# EAGLE schematic onboard_v1.1 (EAGLE 8.1.0)
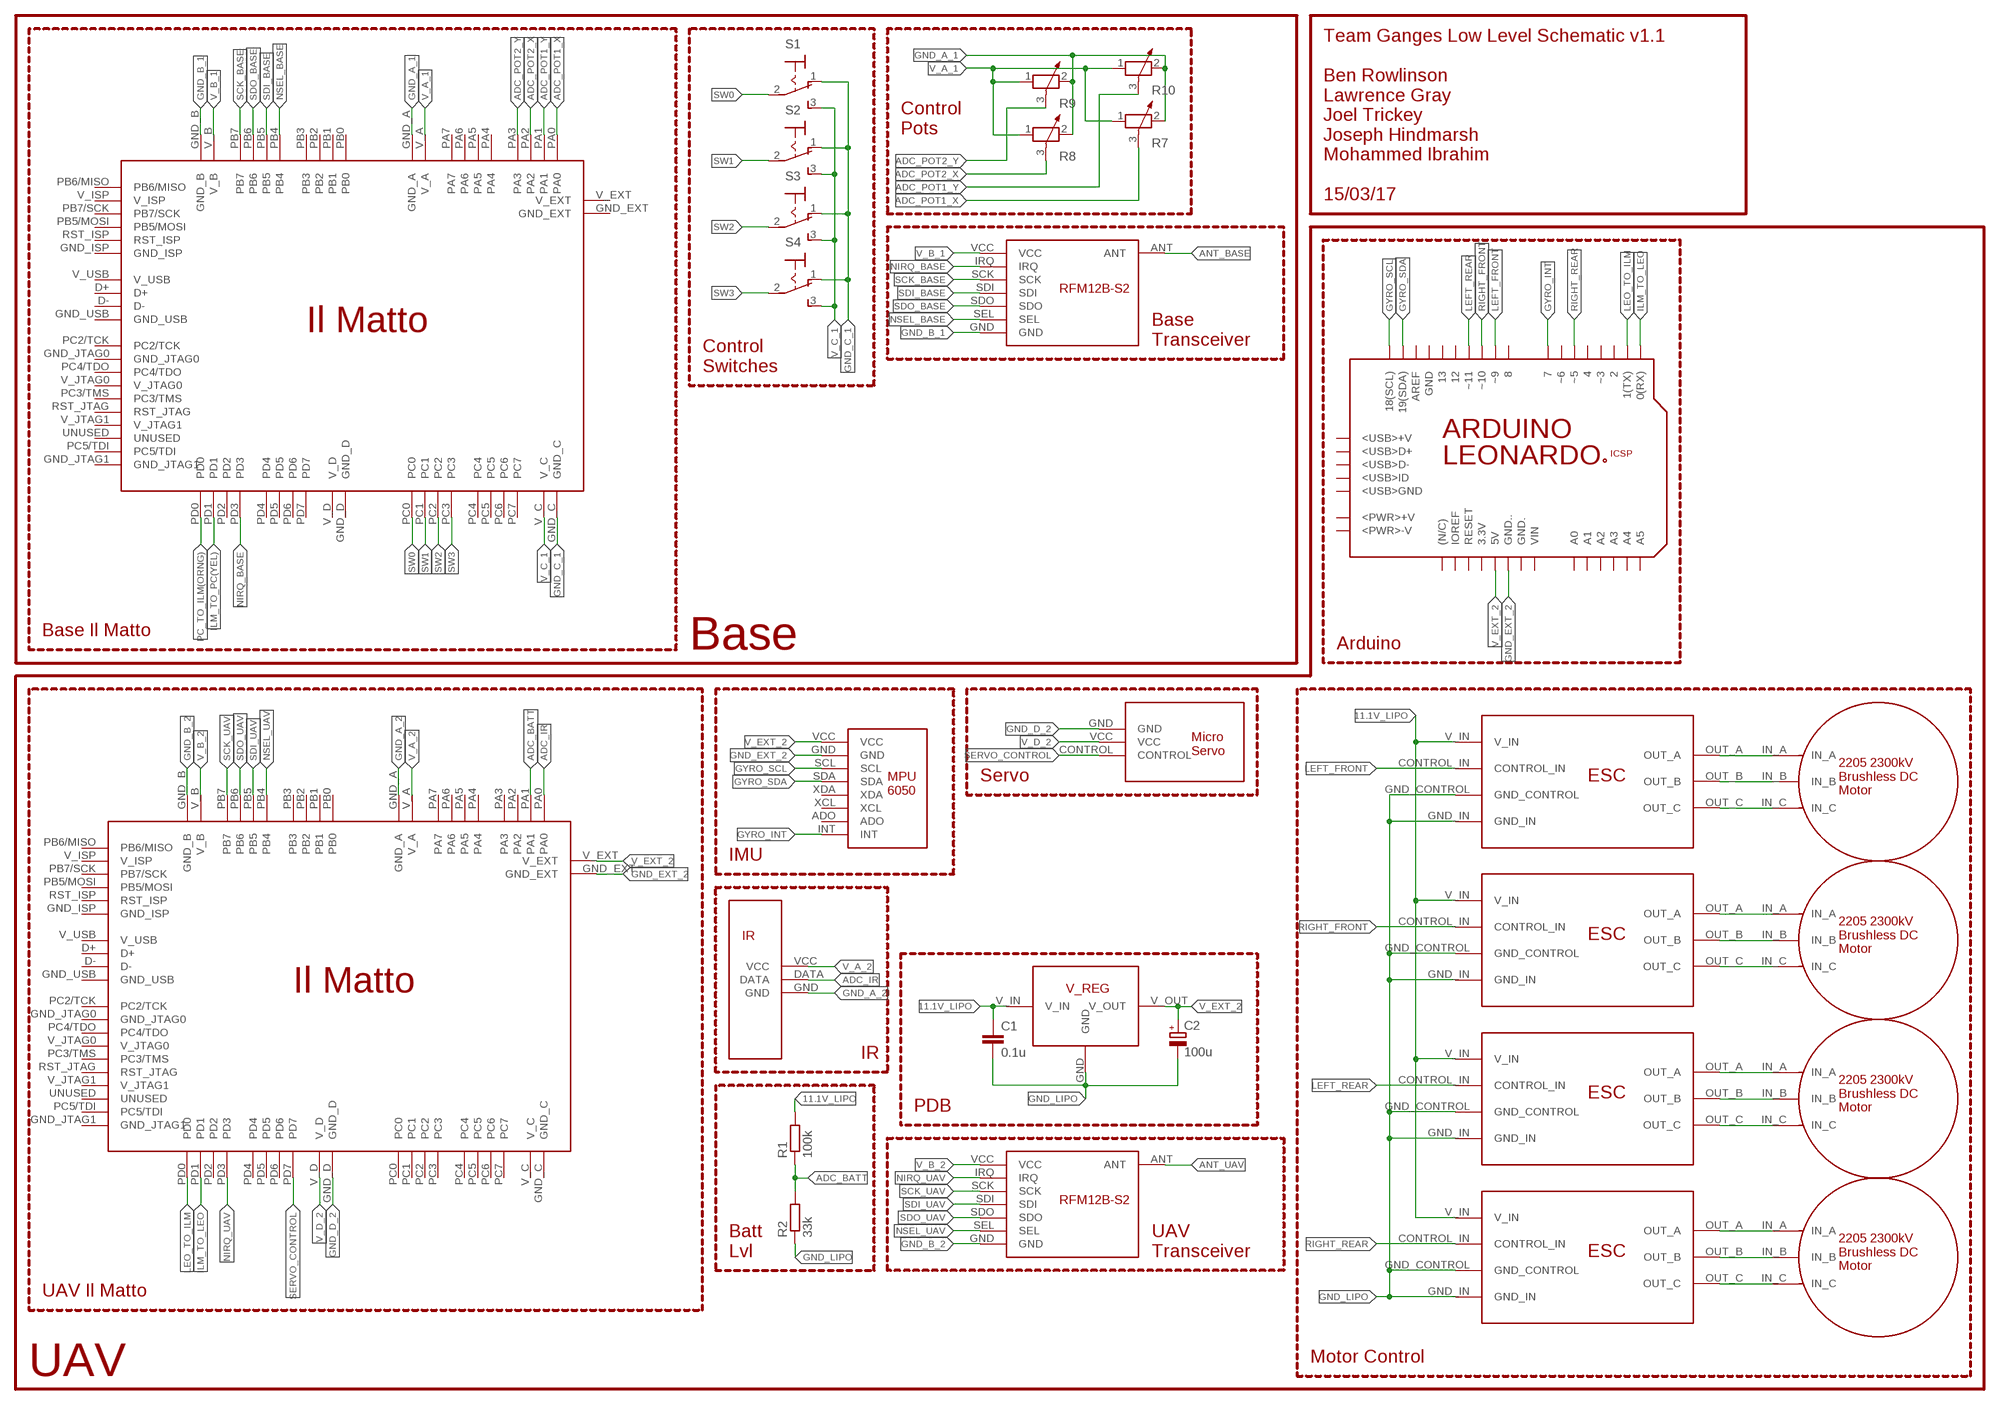
[diagram p0: schematic, sheet 1]

## Parts
C1  0.1u  C-EU025-024X044  [C025-024X044]
C2  100u  CPOL-EUB45181C  [B45181C]
LEFT_FRONT_ESC  ESC  [ESC]
LEFT_FRONT_MOTOR  MOTOR  [MOTOR]
LEFT_REAR_ESC  ESC  [ESC]
LEFT_REAR_MOTOR  MOTOR  [MOTOR]
PCB1  ARDUINO_LEONARDO_EXT  (no package)
R1  100k  R-EU_0204/7  [0204/7]
R2  33k  R-EU_0204/7  [0204/7]
R7  POTENTIOMETER_PT-10  [PT-10]
R8  POTENTIOMETER_PT-10  [PT-10]
R9  POTENTIOMETER_PT-10  [PT-10]
R10  POTENTIOMETER_PT-10  [PT-10]
RIGHT_FRONT_ESC  ESC  [ESC]
RIGHT_FRONT_MOTOR  MOTOR  [MOTOR]
RIGHT_REAR_ESC  ESC  [ESC]
RIGHT_REAR_MOTOR  MOTOR  [MOTOR]
S1  320-916  [320-916]
S2  320-916  [320-916]
S3  320-916  [320-916]
S4  320-916  [320-916]
U$1  IL-MATTO  [IL-MATTO]
U$2  V_REG  [V_REG]
U$3  MPU6050  [MPU6050]
U$4  IR_SENSOR  [IR_SENSOR]
U$5  RFM12B-S2  [RFM12B-S2]
U$6  MICRO_SERVO  [MICRO_SERVO]
U$14  RFM12B-S2  [RFM12B-S2]
U$16  IL-MATTO  [IL-MATTO]

## Nets
11.1V_LIPO: C1.1 LEFT_FRONT_ESC.V_IN LEFT_REAR_ESC.V_IN R1.2 RIGHT_FRONT_ESC.V_IN RIGHT_REAR_ESC.V_IN U$2.V_IN
ADC_BATT: R1.1 R2.2 U$1.PA1
ADC_IR: U$1.PA0 U$4.DATA
ADC_POT1_X: R7.3 U$16.PA0
ADC_POT1_Y: R10.3 U$16.PA1
ADC_POT2_X: R8.3 U$16.PA2
ADC_POT2_Y: R9.3 U$16.PA3
ANT_BASE: U$14.ANT
ANT_UAV: U$5.ANT
GND_A_1: R7.2 R8.2 R9.2 R10.2 U$16.GND_A
GND_A_2: U$1.GND_A U$4.GND
GND_B_1: U$14.GND U$16.GND_B
GND_B_2: U$1.GND_B U$5.GND
GND_C_1: S1.1(O) S2.1(O) S3.1(O) S4.1(O) U$16.GND_C
GND_D_2: U$1.GND_D U$6.GND
GND_EXT_2: PCB1.GND.. U$1.GND_EXT U$3.GND
GND_LIPO: C1.2 C2.- LEFT_FRONT_ESC.GND_CONTROL LEFT_FRONT_ESC.GND_IN LEFT_REAR_ESC.GND_CONTROL LEFT_REAR_ESC.GND_IN R2.1 RIGHT_FRONT_ESC.GND_CONTROL RIGHT_FRONT_ESC.GND_IN RIGHT_REAR_ESC.GND_CONTROL RIGHT_REAR_ESC.GND_IN U$2.GND
GYRO_INT: PCB1.7 U$3.INT
GYRO_SCL: PCB1.18(SCL) U$3.SCL
GYRO_SDA: PCB1.19(SDA) U$3.SDA
ILM_TO_LEO: PCB1.0(RX) U$1.PD1
ILM_TO_PC(YEL): U$16.PD1
LEFT_FRONT: LEFT_FRONT_ESC.CONTROL_IN PCB1.~9
LEFT_REAR: LEFT_REAR_ESC.CONTROL_IN PCB1.~11
LEO_TO_ILM: PCB1.1(TX) U$1.PD0
N$1: LEFT_FRONT_ESC.OUT_A LEFT_FRONT_MOTOR.IN_A
N$2: LEFT_FRONT_ESC.OUT_B LEFT_FRONT_MOTOR.IN_B
N$3: LEFT_FRONT_ESC.OUT_C LEFT_FRONT_MOTOR.IN_C
N$4: RIGHT_FRONT_ESC.OUT_A RIGHT_FRONT_MOTOR.IN_A
N$5: RIGHT_FRONT_ESC.OUT_B RIGHT_FRONT_MOTOR.IN_B
N$6: RIGHT_FRONT_ESC.OUT_C RIGHT_FRONT_MOTOR.IN_C
N$7: LEFT_REAR_ESC.OUT_A LEFT_REAR_MOTOR.IN_A
N$8: LEFT_REAR_ESC.OUT_B LEFT_REAR_MOTOR.IN_B
N$9: LEFT_REAR_ESC.OUT_C LEFT_REAR_MOTOR.IN_C
N$10: RIGHT_REAR_ESC.OUT_A RIGHT_REAR_MOTOR.IN_A
N$11: RIGHT_REAR_ESC.OUT_B RIGHT_REAR_MOTOR.IN_B
N$12: RIGHT_REAR_ESC.OUT_C RIGHT_REAR_MOTOR.IN_C
NIRQ_BASE: U$14.IRQ U$16.PD3
NIRQ_UAV: U$1.PD3 U$5.IRQ
NSEL_BASE: U$14.SEL U$16.PB4
NSEL_UAV: U$1.PB4 U$5.SEL
PC_TO_ILM(ORNG): U$16.PD0
RIGHT_FRONT: PCB1.~10 RIGHT_FRONT_ESC.CONTROL_IN
RIGHT_REAR: PCB1.~5 RIGHT_REAR_ESC.CONTROL_IN
SCK_BASE: U$14.SCK U$16.PB7
SCK_UAV: U$1.PB7 U$5.SCK
SDI_BASE: U$14.SDI U$16.PB5
SDI_UAV: U$1.PB5 U$5.SDI
SDO_BASE: U$14.SDO U$16.PB6
SDO_UAV: U$1.PB6 U$5.SDO
SERVO_CONTROL: U$1.PD7 U$6.CONTROL
SW0: S1.2(P) U$16.PC0
SW1: S2.2(P) U$16.PC1
SW2: S3.2(P) U$16.PC2
SW3: S4.2(P) U$16.PC3
V_A_1: R7.1 R8.1 R9.1 R10.1 U$16.V_A
V_A_2: U$1.V_A U$4.VCC
V_B_1: U$14.VCC U$16.V_B
V_B_2: U$1.V_B U$5.VCC
V_C_1: S1.3(S) S2.3(S) S3.3(S) S4.3(S) U$16.V_C
V_D_2: U$1.V_D U$6.VCC
V_EXT_2: C2.+ PCB1.5V U$1.V_EXT U$2.V_OUT U$3.VCC
Unconnected: PCB1.2 PCB1.3.3V PCB1.4 PCB1.8 PCB1.12 PCB1.13 PCB1.(N/C) PCB1.+5V PCB1.<PWR>+V PCB1.<PWR>-V PCB1.<USB>+V PCB1.<USB>D+ PCB1.<USB>D- PCB1.<USB>GND PCB1.<USB>ID PCB1.A0 PCB1.A1 PCB1.A2 PCB1.A3 PCB1.A4 PCB1.A5 PCB1.AREF PCB1.GND PCB1.GND. PCB1.GND_ PCB1.IOREF PCB1.MISO PCB1.MOSI PCB1.RESET PCB1.RESET. PCB1.SCK PCB1.VIN PCB1.~3 PCB1.~6 U$1.D+ U$1.D- U$1.GND_C U$1.GND_ISP U$1.GND_JTAG0 U$1.GND_JTAG1 U$1.GND_USB U$1.PA2 U$1.PA3 U$1.PA4 U$1.PA5 U$1.PA6 U$1.PA7 U$1.PB0 U$1.PB1 U$1.PB2 U$1.PB3 U$1.PB5/MOSI U$1.PB6/MISO U$1.PB7/SCK U$1.PC0 U$1.PC1 U$1.PC2 U$1.PC2/TCK U$1.PC3 U$1.PC3/TMS U$1.PC4 U$1.PC4/TDO U$1.PC5 U$1.PC5/TDI U$1.PC6 U$1.PC7 U$1.PD2 U$1.PD4 U$1.PD5 U$1.PD6 U$1.RST_ISP U$1.RST_JTAG U$1.UNUSED U$1.V_C U$1.V_ISP U$1.V_JTAG0 U$1.V_JTAG1 U$1.V_USB U$3.ADO U$3.XCL U$3.XDA U$16.D+ U$16.D- U$16.GND_D U$16.GND_EXT U$16.GND_ISP U$16.GND_JTAG0 U$16.GND_JTAG1 U$16.GND_USB U$16.PA4 U$16.PA5 U$16.PA6 U$16.PA7 U$16.PB0 U$16.PB1 U$16.PB2 U$16.PB3 U$16.PB5/MOSI U$16.PB6/MISO U$16.PB7/SCK U$16.PC2/TCK U$16.PC3/TMS U$16.PC4 U$16.PC4/TDO U$16.PC5 U$16.PC5/TDI U$16.PC6 U$16.PC7 U$16.PD2 U$16.PD4 U$16.PD5 U$16.PD6 U$16.PD7 U$16.RST_ISP U$16.RST_JTAG U$16.UNUSED U$16.V_D U$16.V_EXT U$16.V_ISP U$16.V_JTAG0 U$16.V_JTAG1 U$16.V_USB

## Notes on the sheet
- Team Ganges Low Level Schematic v1.1
- Control
  Pots
- Ben Rowlinson
  Lawrence Gray
  Joel Trickey
  Joseph Hindmarsh
  Mohammed Ibrahim
- 15/03/17
- Base
  Transceiver
- Control
  Switches
- Base Il Matto
- Base | Arduino
- Servo
- IMU
- IR
- PDB
- Batt
  Lvl
- UAV
  Transceiver
- UAV Il Matto
- Motor Control
- UAV

## Library data of the parts
C1 = rcl:C-EU: CAPACITOR, European symbol
C2 = rcl:CPOL-EU: POLARIZED CAPACITOR, European symbol
LEFT_FRONT_ESC LEFT_REAR_ESC RIGHT_FRONT_ESC RIGHT_REAR_ESC = ganges:ESC: ESC for Schematic
LEFT_FRONT_MOTOR LEFT_REAR_MOTOR RIGHT_FRONT_MOTOR RIGHT_REAR_MOTOR = ganges:MOTOR: 2205 2300kV Brushless DC Motor - Device
PCB1 = E14_Arduino_revC:ARDUINO_LEONARDO_EXT: Device for representing an Arduino Leonardo board in an EAGLE design without the PCB footprint. Created by Dave Young for Element14. More EAGLE documentation at: http://www.element14.com/community/community/knode/cadsoft_eagle
R1 R2 = rcl:R-EU_: RESISTOR, European symbol
R7-R10 = rcl:POTENTIOMETER_: Potentiometer
S1-S4 = switch:320-916: TOGGLE SWITCH distributor RS Components
U$1 U$16 = ganges:IL-MATTO: Il Matto Board - Device
U$2 = ganges:V_REG: Device of Voltage Regulator we used, the name of which eludes me at present. Call it something like lt293???? Anyway it's a 5V regulator
U$3 = ganges:MPU6050: MPU6050 Breakout Board Module - Gyroscope and Accelerometer
U$4 = ganges:IR_SENSOR: SHARP 2Y0A21 IR Proximity Sensor - Device
U$5 U$14 = ganges:RFM12B-S2: RFM12B-S2 Transceiver Module - Device
U$6 = ganges:MICRO_SERVO: SM-S2309S Micro Servo - Device